# Altium project PROC154E3_SCH.PrjPcb (part 48 of 60)

## Sheet 51. POWER SUPPLY #2.SchDoc: POWER SUPPLY #2
size 513 x 386 mm; Project: PROC154E2(001)_SK_AM69; Issue: 1.0; RevCode: E3; Page Create Date: March  8, 1995; Variant Name: Core Design; Schematic Page Number: 51; Page Number: 51; Page Size: C; Comment: MISTRAL_TITLEBLK_CSIZE_1; Page Count: 62; Schematic Page Count: 62; Name: PROC154E2 001 SK AM69; DsnPath: C:\Users\danie\Downloads\sprr466c\PROC154E3_RP\PROC154E3_SCH.DSN; SchematicName: SCHEMATIC1; PageName: 51. POWER SUPPLY #2; PageSize: C; TopSchematic: True
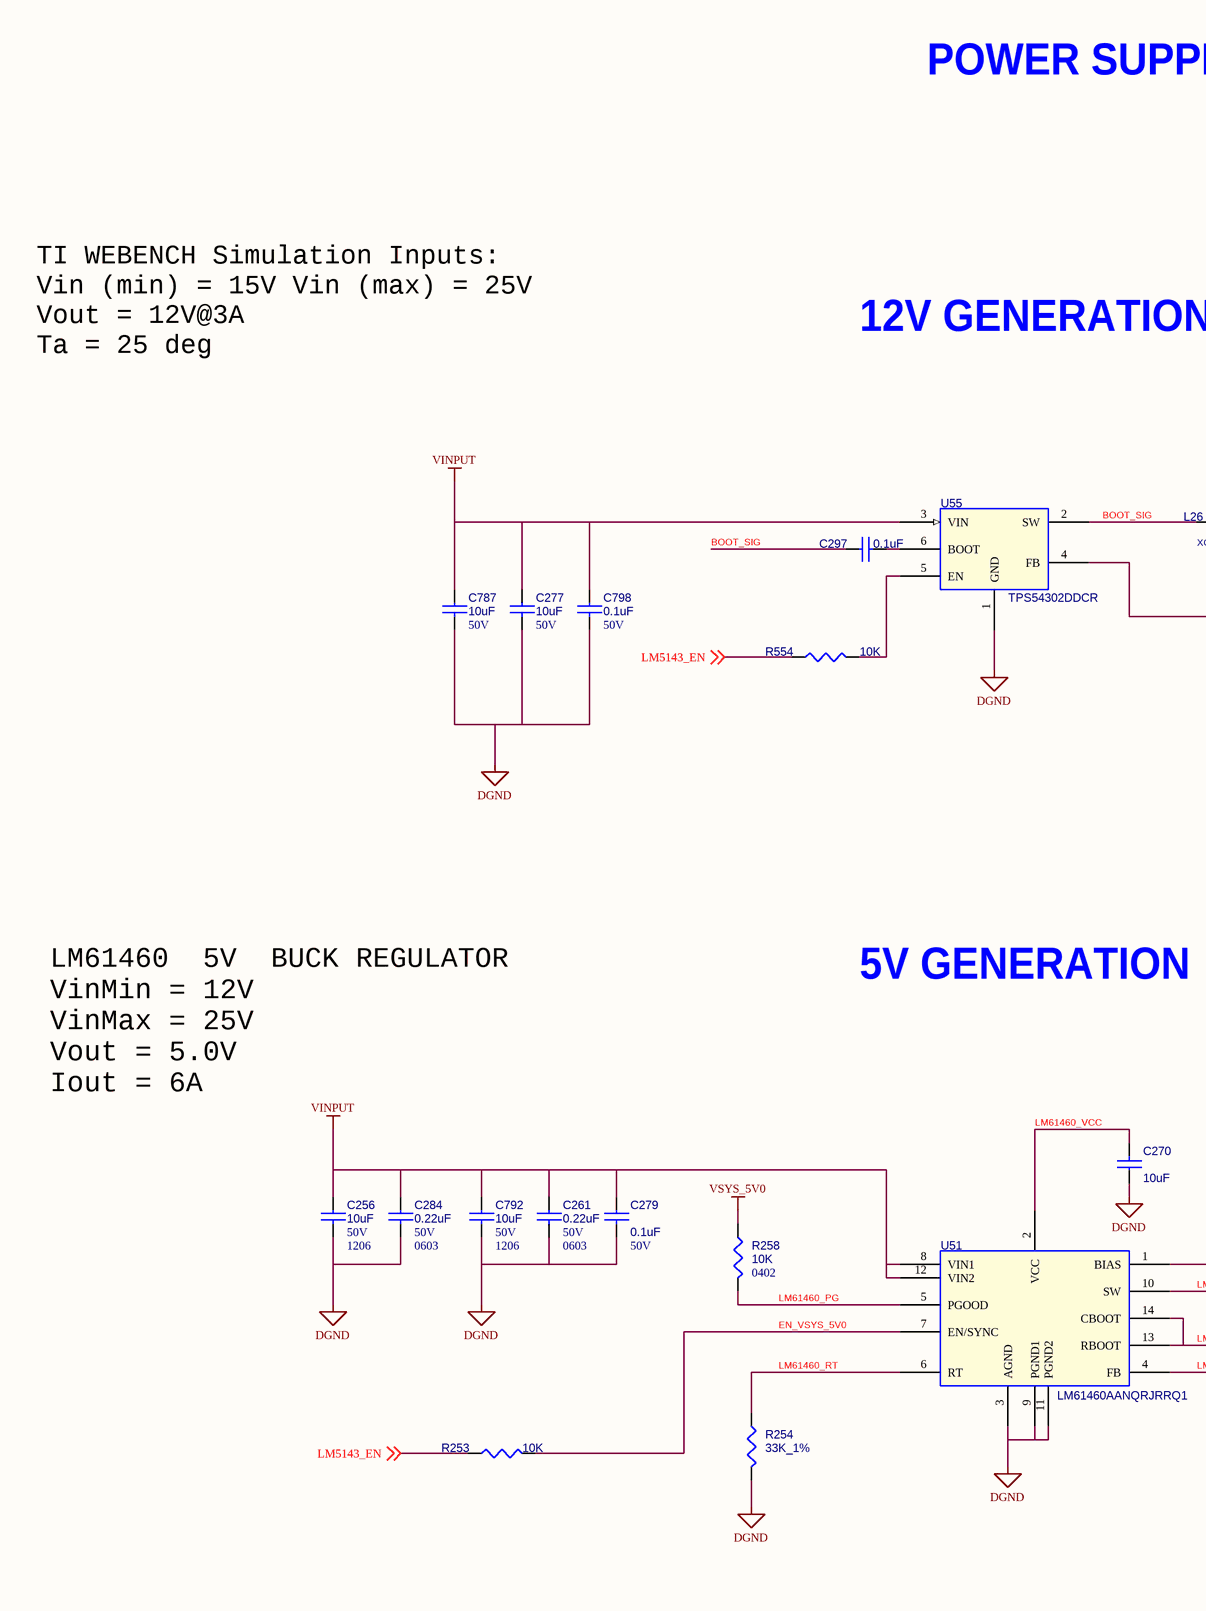
[diagram p85: 51. POWER SUPPLY #2.SchDoc, left]
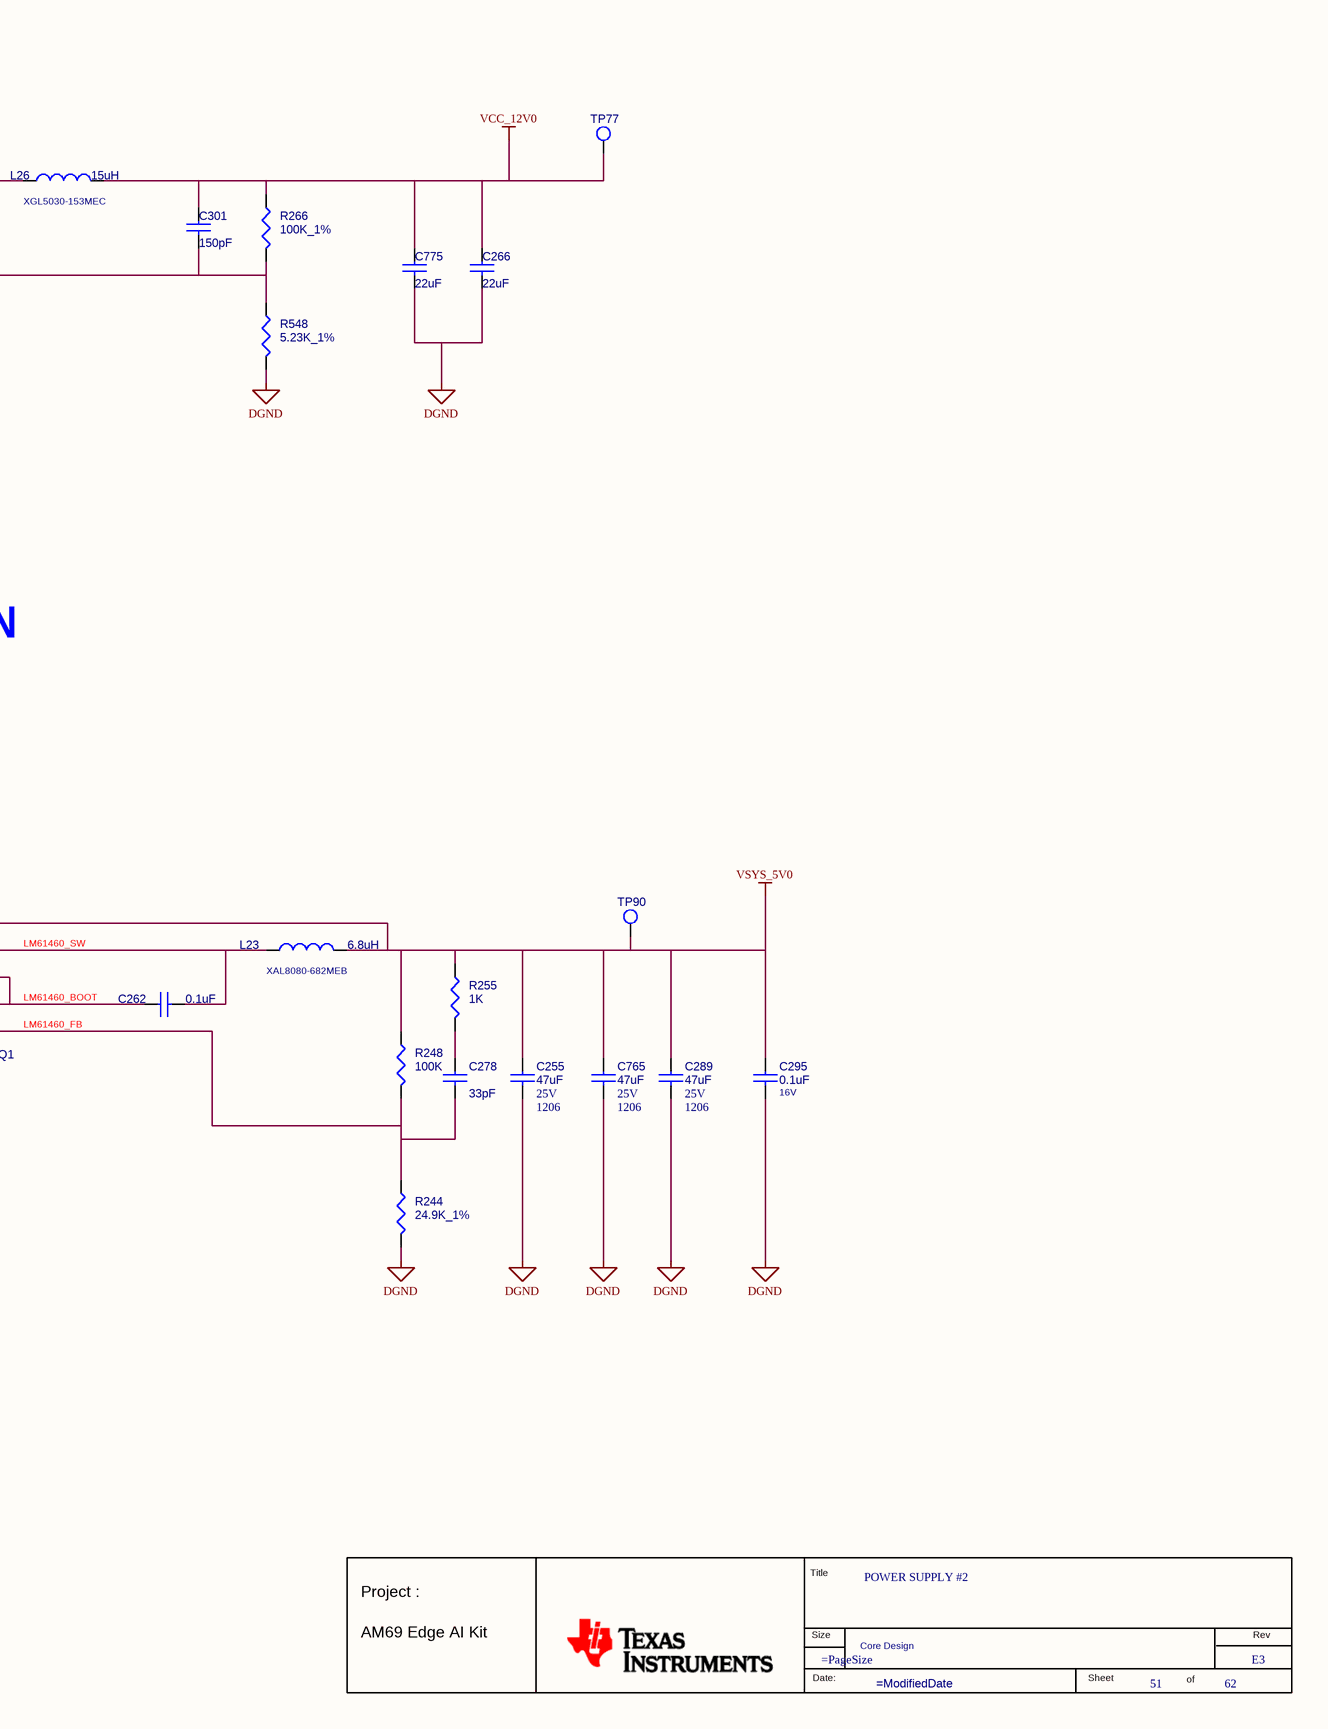
[diagram p86: 51. POWER SUPPLY #2.SchDoc, right]

### Parts
(Parts that share a designator on the sheet are numbered #1, #2 ... from top to bottom, then left to right.)
*#51  RevCode: E3  Title: POWER SUPPLY #2  Page Number: 51  Page Count: 62  Variant Name: Core Design  (hidden comment: MISTRAL_TITLEBLK_CSIZE_1)  (graphical)
C255  47uF  Voltage: 25V  Package: 1206  [CAP1206_2]
C256  10uF  Package: 1206  Voltage: 50V  [CAP1206_2]
C261  0.22uF  Voltage: 50V  Package: 0603  [CAP0603_1]
C262  0.1uF  [CAP0402_0-75]
C266  22uF  [CAP0805_1-5]
C270  10uF  [CAP0402_1]
C277  10uF  Voltage: 50V  [CAP1206_2]
C278  33pF  [CAP0402_0-75]
C279  0.1uF  Voltage: 50V  [CAP0402_0-75]
C284  0.22uF  Package: 0603  Voltage: 50V  [CAP0603_1]
C289  47uF  Voltage: 25V  Package: 1206  [CAP1206_2]
C295  0.1uF  Voltage: 16V  [CAP0402_0-75]
C297  0.1uF  [CAP0805_1]
C301  150pF  [CAP0201_0-5]
C765  47uF  Package: 1206  Voltage: 25V  [CAP1206_2]
C775  22uF  [CAP0805_1-5]
C787  10uF  Voltage: 50V  [CAP1206_2]
C792  10uF  Voltage: 50V  Package: 1206  [CAP1206_2]
C798  0.1uF  Voltage: 50V  [CAP0402_0-75]
L23  6.8uH  Mfr_part_number: XAL8080-682MEB  [IND_XAL8080_330X350_SMD_8]
L26  15uH  Mfr_part_number: XGL5030-153MEC  [IND_XGL5030_220X220_SMD_3-1]
R244  24.9K_1%  [RES0402_0-5]
R248  100K  [RES0402_0-5]
R253  10K  [RES0402_0-5]
R254  33K_1%  [RES0603_0-75]
R255  1K  [RES0201_0-5]
R258  10K  Package: 0402  [RES0402_0-5]
R266  100K_1%  [RES0402_0-5]
R548  5.23K_1%  [RES0402_0-5]
R554  10K  [RES0402_0-5]
TP77  TP30_SMD  [TP30_SMD]  (value not drawn)
TP90  THRU HOLE  [TP_40X65]  (value not drawn)
U51  LM61460AANQRJRRQ1  [VQFNHR14_LM61460_160X140_1]
U55  TPS54302DDCR  [SOT23-6_1-1]

### Nets
DGND: C255.2 C256.2 C261.2 C266.2 C270.1 C277.2 C279.2 C284.2 C289.2 C295.2 C765.2 C775.2 C787.2 C792.2 C798.2 R244.2 R254.2 R548.2 U51.3(AGND) U51.9(PGND1) U51.11(PGND2) U55.1(GND)  [project net VDD_CPU_HCPS_GOSNS]
VCC_12V0: C266.1 C301.1 C775.1 L26.2 R266.1 TP77.1(TP)
VINPUT: C256.1 C261.1 C277.1 C279.1 C284.1 C787.1 C792.1 C798.1 U51.8(VIN1) U51.12(VIN2) U55.3(VIN)
VSYS_5V0: C255.1 C289.1 C295.1 C765.1 L23.2 R248.1 R255.1 R258.2 TP90.1(TP) U51.1(BIAS)
BOOT_SIG: C297.1 L26.1 U55.2(SW)
EN_VSYS_5V0: R253.1 U51.7(EN/SYNC)
LM5143_EN: R253.2 R554.2 ; off-sheet LM5143_EN  [project net LM5143_ON]
LM61460_BOOT: C262.1 U51.13(RBOOT) U51.14(CBOOT)
LM61460_FB: C278.2 R244.1 R248.2 U51.4(FB)
LM61460_PG: R258.1 U51.5(PGOOD)
LM61460_RT: R254.1 U51.6(RT)
LM61460_SW: C262.2 L23.1 U51.10(SW)
LM61460_VCC: C270.2 U51.2(VCC)
NetC278_1: C278.1 R255.2
NetC297_2: C297.2 U55.6(BOOT)
NetC301_2: C301.2 R266.2 R548.1 U55.4(FB)
NetR554_1: R554.1 U55.5(EN)

### Notes on the sheet
- POWER SUPPLY #2
- TI WEBENCH Simulation Inputs:
  Vin (min) = 15V Vin (max) = 25V
  Vout = 12V@3A
  Ta = 25 deg
- 12V GENERATION
- LM61460  5V  BUCK REGULATOR
  VinMin = 12V
  VinMax = 25V
  Vout = 5.0V
  Iout = 6A
- 5V GENERATION
- (in symbol MISTRAL_TITLEBLK_CSIZE_1) Title; Project :; Size; Rev; AM69 Edge AI Kit; Date:; Sheet; of

### Library data of the parts
*#51 = MISTRAL_TITLEBLK_CSIZE_1: Issue: 1.0; Project: PROC154E2(001)_SK_AM69; Name: PROC154E2 001 SK AM69; Page Create Date: March  8, 1995; Page Size: =PageSize; Page Modify Date: =ModifiedDate; Schematic Page Count: 62; Schematic Page Number: 51
C255 = CAP_Dup1: CAP CERAMIC 47uF 25V 20% X5R 1206; Part Reference: C255; Mistral Part No: 120013050002-R; Mfr_name: TDK CORPORATION; Mfr_part_number: C3216X5R1E476M160AC; Part_type: CAPACITORS\CERAMIC; Project: ERP; Wattage: NA; Customs_HS_Code: 85322990; Custom_Duty: 15%; Value: 47uF; Footprint Ref: CAP1206_2; Tolerance: 20%; Distributor_name: DIGIKEY; Distributor_part_number: 445-8047-1-ND; Library Ref: CAP; Height: 1.80MM; Weight: 16.2mg; Temperature: -55°C+85°C; Datasheet: Y:\MIS_DATABASE\DATASHEETS\CAPACITORS\TDK_C-SER-JUL17.PDF; Crtd /date: USMAN/160513; Chkd/date: VASANTHA/261214; MECHANICAL 3D STEP FILE: CAP1206_2; Library Path: Y:\MIS_DATABASE\Library\ALTIUM_TOOL\SCHEMATICS_PARTS\MS_DISCRETE_Library.schlib; Footprint Path: Y:\MIS_DATABASE\Library\ALTIUM_TOOL\PCB_FOOTPRINTS\Altium_Footprint_Lib.PcbLib; PCB Footprint: CAP1206_2
C256 = CAP_Dup1: CAP CERAMIC 10uF 50V 10% X5R AUTO 1206; Part Reference: C256; Part_type: CAPACITORS\CERAMIC; Mfr_part_number: GRT31CR61H106KE01L; Mfr_name: MURATA; Mistral Part No: 120011060019-R; Custom_Duty: 15%; Customs_HS_Code: 85322990; Wattage: NA; Project: LRDE_ABCMV2_MB; Value: 10uF; Footprint Path: Y:\MIS_DATABASE\Library\ALTIUM_TOOL\PCB_FOOTPRINTS\Altium_Footprint_Lib.PcbLib; Library Path: Y:\MIS_DATABASE\Library\ALTIUM_TOOL\SCHEMATICS_PARTS\MS_DISCRETE_Library.schlib; MECHANICAL 3D STEP FILE: CAP1206_2; Chkd/date: MANIRAJA/261018; Crtd /date: ALVY/261018; Datasheet: Y:\MIS_DATABASE\DATASHEETS\CAPACITORS\GRT31CR61H106KE01L.PDF; Temperature: -55°C+85°C; Weight: 16.2mg; Height: 1.80MM; Library Ref: CAP; Distributor_part_number: 490-12456-1-ND; Distributor_name: DIGIKEY; Tolerance: 10%; Footprint Ref: CAP1206_2; PCB Footprint: CAP1206_2
C261 = CAP_Dup1: CAP CERAMIC 0.22uF 50V 10% X7R AUTO 0603; Part Reference: C261; Mistral Part No: 120009090008-R; Mfr_name: MURATA; Mfr_part_number: GCM188R71H224KA64; Part_type: CAPACITORS\CERAMIC; Direct Alternate_mfr_name: TDK; Direct Alternate_mfr_part_number: CGA3E3X7R1H224K080AB; Automotive Alternate_mfr_part_number: CGA3EX7R1H224K080AB; Project: ADE POWER SUPPLY; Wattage: NA; Customs_HS_Code: 85322990; Custom_Duty: 15%; Value: 0.22uF; Footprint Ref: CAP0603_1; Tolerance: 10%; Distributor_name: DIGIKEY; Distributor_part_number: 490-5402-1-ND; Library Ref: CAP; Height: 0.90MM; Weight: 6.3mg; Temperature: -55°C+125°C; Datasheet: Y:\MIS_DATABASE\DATASHEETS\CAPACITORS\MURATA-GCM-SER.PDF; Crtd /date: MAZHAR/110909; Chkd/date: RAGESH/290910; MECHANICAL 3D STEP FILE: CAP0603_1; Library Path: Y:\MIS_DATABASE\Library\ALTIUM_TOOL\SCHEMATICS_PARTS\MS_DISCRETE_Library.schlib; Footprint Path: Y:\MIS_DATABASE\Library\ALTIUM_TOOL\PCB_FOOTPRINTS\Altium_Footprint_Lib.PcbLib; Automotive Alternate_mfr_name: TDK; PCB Footprint: CAP0603_1
C262 = CAP_Dup1: CAP CERAMIC 0.1uF 16V 10% X7R AUTO 0402; Part Reference: C262; Mistral Part No: 120016070006-R; Mfr_name: MURATA; Mfr_part_number: GCM155R71C104KA55D; Part_type: CAPACITORS\CERAMIC; Direct Alternate_mfr_part_number: GCM155R71C104JA55D; Automotive Alternate_mfr_name: TDK; Automotive Alternate_mfr_part_number: CGA2B1X7R1C104K050BC; Project: DCMIST_FPGA_CARD; Wattage: NA; Customs_HS_Code: 85322990; Custom_Duty: 15%; Value: 0.1uF; Footprint Ref: CAP0402_0-75; Tolerance: 10%; Voltage: 16V; Package: 0402; Distributor_name: DIGIKEY; Distributor_part_number: 490-4759-1-ND; Library Ref: CAP; Height: 0.55MM; Weight: 6mg; Temperature: -55°C+125°C; Datasheet: Y:\MIS_DATABASE\DATASHEETS\CAPACITORS\MURATA-GCM-SER.PDF; Crtd /date: VASANTHA/300514; Chkd/date: NAVEED/021014; MECHANICAL 3D STEP FILE: CAP0402_0-75; Library Path: Y:\MIS_DATABASE\Library\ALTIUM_TOOL\SCHEMATICS_PARTS\MS_DISCRETE_Library.schlib; Footprint Path: Y:\MIS_DATABASE\Library\ALTIUM_TOOL\PCB_FOOTPRINTS\Altium_Footprint_Lib.PcbLib; Direct Alternate_mfr_name: MURATA; PCB Footprint: CAP0402_0-75
C266 = CAP_Dup1: CAP CERAMIC 22uF 25V 20% X5R 0805; Part Reference: C266; Part_type: CAPACITORS\CERAMIC; Mfr_part_number: GRM21BR61E226ME44K; Mfr_name: MURATA; Mistral Part No: 120013120018-R; Custom_Duty: 15%; Customs_HS_Code: 85322990; Wattage: NA; Project: TI_J7SVB_PCIE_ADD-ON-CARD; Value: 22uF; MECHANICAL 3D STEP FILE: CAP0805_1-5; Chkd/date: MANIRAJA/110718; Crtd /date: ALVY/110718; Datasheet: Y:\MIS_DATABASE\DATASHEETS\CAPACITORS\GRM21BR61E226ME44K.PDF; Temperature: -55°C+85°C; Weight: 9.5mg; Height: 1.45MM; Library Ref: CAP; Distributor_part_number: 490-14661-1-ND; Distributor_name: DIGIKEY; Package: 0805; Voltage: 25V; Tolerance: 20%; Footprint Ref: CAP0805_1-5; Library Path: Y:\MIS_DATABASE\Library\ALTIUM_TOOL\SCHEMATICS_PARTS\MS_DISCRETE_Library.schlib; Footprint Path: Y:\MIS_DATABASE\Library\ALTIUM_TOOL\PCB_FOOTPRINTS\Altium_Footprint_Lib.PcbLib; PCB Footprint: CAP0805_1-5
C270 = CAP_Dup1: CAP CERAMIC 10uF 10V 20% X5R 0402; Part Reference: C270; Part_type: CAPACITORS\CERAMIC; Mfr_part_number: CL05A106MP8NUB8; Mfr_name: SAMSUNG; Mistral Part No: 120019020008-R; Custom_Duty: 15%; Customs_HS_Code: 85322990; Wattage: NA; Project: TI_60GHz-AOP; Value: 10uF; Footprint Path: Y:\MIS_DATABASE\Library\ALTIUM_TOOL\PCB_FOOTPRINTS\Altium_Footprint_Lib.PcbLib; Library Path: Y:\MIS_DATABASE\Library\ALTIUM_TOOL\SCHEMATICS_PARTS\MS_DISCRETE_Library.schlib; MECHANICAL 3D STEP FILE: CAP0402_1; Chkd/date: MANIRAJA/150219; Crtd /date: ALVY/150219; Datasheet: Y:\MIS_DATABASE\DATASHEETS\CAPACITORS\CL05A106MP8NUB8.PDF; Temperature: -55°C+85°C; Weight: NA; Height: 0.90MM; Library Ref: CAP; Distributor_part_number: 1276-6830-1-ND; Distributor_name: DIGIKEY; Package: 0402; Voltage: 10V; Tolerance: 20%; Footprint Ref: CAP0402_1; PCB Footprint: CAP0402_1
C277 = CAP_Dup1: CAP CERAMIC 10uF 50V 10% X5R AUTO 1206; Part Reference: C277; Mistral Part No: 120011060019-R; Mfr_name: MURATA; Mfr_part_number: GRT31CR61H106KE01L; Part_type: CAPACITORS\CERAMIC; Direct Alternate_mfr_name: SAMSUNG; Direct Alternate_mfr_part_number: CL31A106KBHNNNE; Automotive Alternate_mfr_name: TDK; Automotive Alternate_mfr_part_number: CGA5L1X7R1H106K160AC; Project: LRDE_ABCMV2_MB; Wattage: NA; Customs_HS_Code: 85322990; Custom_Duty: 15%; Value: 10uF; Footprint Path: Y:\MIS_DATABASE\Library\ALTIUM_TOOL\PCB_FOOTPRINTS\Altium_Footprint_Lib.PcbLib; Library Path: Y:\MIS_DATABASE\Library\ALTIUM_TOOL\SCHEMATICS_PARTS\MS_DISCRETE_Library.schlib; Footprint Ref: CAP1206_2; MECHANICAL 3D STEP FILE: CAP1206_2; Tolerance: 10%; Package: 1206; Distributor_name: DIGIKEY; Distributor_part_number: 490-12456-1-ND; Library Ref: CAP; Height: 1.80MM; Weight: 16.2mg; Temperature: -55°C+85°C; Datasheet: Y:\MIS_DATABASE\DATASHEETS\CAPACITORS\GRT31CR61H106KE01L.PDF; Crtd /date: ALVY/261018; Chkd/date: MANIRAJA/261018; PCB Footprint: CAP1206_2
C278 = CAP_Dup1: CAP CERAMIC 33pF 50V 5% HI-Q C0G(NP0) AUTO 0402; Part Reference: C278; Mistral Part No: 120021020039-R; Mfr_name: MURATA; Mfr_part_number: GCQ1555C1H330JB01D; Part_type: CAPACITORS\CERAMIC; Project: TI_DRA821 SK EVM BRD; Wattage: NA; Customs_HS_Code: 85322990; Custom_Duty: 15%; Value: 33pF; Footprint Ref: CAP0402_0-75; Tolerance: 5%; Voltage: 50V; Package: 0402; Distributor_name: DIGIKEY; Distributor_part_number: 490-17458-1-ND; Library Ref: CAP; Height: 0.55MM; Weight: NA; Temperature: -55°C+125°C; Datasheet: Y:\MIS_DATABASE\DATASHEETS\CAPACITORS\GCQ1555C1H330JB01.PDF; Crtd /date: ALVY/240221; Chkd/date: MANIRAJA/250221; MECHANICAL 3D STEP FILE: CAP0402_0-75; Library Path: Y:\MIS_DATABASE\Library\ALTIUM_TOOL\SCHEMATICS_PARTS\MS_DISCRETE_Library.schlib; Footprint Path: Y:\MIS_DATABASE\Library\ALTIUM_TOOL\PCB_FOOTPRINTS\Altium_Footprint_Lib.PcbLib; PCB Footprint: CAP0402_0-75
C279 = CAP_Dup1: CAP CERAMIC 0.1uF 50V 10% X7R AUTO 0402; Part Reference: C279; Mistral Part No: 120019030005-R; Mfr_name: MURATA; Mfr_part_number: GRT155R71H104KE01D; Part_type: CAPACITORS\CERAMIC; Project: TI_DRA821 SK EVM BRD; Wattage: NA; Customs_HS_Code: 85322990; Custom_Duty: 15%; Value: 0.1uF; Footprint Ref: CAP0402_0-75; Tolerance: 10%; Package: 0402; Distributor_name: MOUSER; Distributor_part_number: 81-GRT155R71H104KE1D; Library Ref: CAP; Height: 0.55MM; Weight: NA; Temperature: -55°C+125°C; Datasheet: Y:\MIS_DATABASE\DATASHEETS\CAPACITORS\GRT155R71H104KE01.PDF; Crtd /date: ALVY/240221; Chkd/date: MANIRAJA/250221; MECHANICAL 3D STEP FILE: CAP0402_0-75; Library Path: Y:\MIS_DATABASE\Library\ALTIUM_TOOL\SCHEMATICS_PARTS\MS_DISCRETE_Library.schlib; Footprint Path: Y:\MIS_DATABASE\Library\ALTIUM_TOOL\PCB_FOOTPRINTS\Altium_Footprint_Lib.PcbLib; PCB Footprint: CAP0402_0-75
C284 = CAP_Dup1: CAP CERAMIC 0.22uF 50V 10% X7R AUTO 0603; Part Reference: C284; Part_type: CAPACITORS\CERAMIC; Mfr_part_number: GCM188R71H224KA64; Mfr_name: MURATA; Mistral Part No: 120009090008-R; Direct Alternate_mfr_name: TDK; Direct Alternate_mfr_part_number: CGA3E3X7R1H224K080AB; Automotive Alternate_mfr_part_number: CGA3EX7R1H224K080AB; Custom_Duty: 15%; Customs_HS_Code: 85322990; Wattage: NA; Project: ADE POWER SUPPLY; Value: 0.22uF; Footprint Path: Y:\MIS_DATABASE\Library\ALTIUM_TOOL\PCB_FOOTPRINTS\Altium_Footprint_Lib.PcbLib; Library Path: Y:\MIS_DATABASE\Library\ALTIUM_TOOL\SCHEMATICS_PARTS\MS_DISCRETE_Library.schlib; MECHANICAL 3D STEP FILE: CAP0603_1; Chkd/date: RAGESH/290910; Crtd /date: MAZHAR/110909; Datasheet: Y:\MIS_DATABASE\DATASHEETS\CAPACITORS\MURATA-GCM-SER.PDF; Temperature: -55°C+125°C; Weight: 6.3mg; Height: 0.90MM; Library Ref: CAP; Distributor_part_number: 490-5402-1-ND; Distributor_name: DIGIKEY; Tolerance: 10%; Footprint Ref: CAP0603_1; Automotive Alternate_mfr_name: TDK; PCB Footprint: CAP0603_1
C289 = CAP_Dup1: CAP CERAMIC 47uF 25V 20% X5R 1206; Part Reference: C289; Mistral Part No: 120013050002-R; Mfr_name: TDK CORPORATION; Mfr_part_number: C3216X5R1E476M160AC; Part_type: CAPACITORS\CERAMIC; Project: ERP; Wattage: NA; Customs_HS_Code: 85322990; Custom_Duty: 15%; Value: 47uF; Footprint Ref: CAP1206_2; Tolerance: 20%; Distributor_name: DIGIKEY; Distributor_part_number: 445-8047-1-ND; Library Ref: CAP; Height: 1.80MM; Weight: 16.2mg; Temperature: -55°C+85°C; Datasheet: Y:\MIS_DATABASE\DATASHEETS\CAPACITORS\TDK_C-SER-JUL17.PDF; Crtd /date: USMAN/160513; Chkd/date: VASANTHA/261214; MECHANICAL 3D STEP FILE: CAP1206_2; Library Path: Y:\MIS_DATABASE\Library\ALTIUM_TOOL\SCHEMATICS_PARTS\MS_DISCRETE_Library.schlib; Footprint Path: Y:\MIS_DATABASE\Library\ALTIUM_TOOL\PCB_FOOTPRINTS\Altium_Footprint_Lib.PcbLib; PCB Footprint: CAP1206_2
C295 = CAP_Dup1: CAP CERAMIC 0.1uF 16V 10% X7R AUTO 0402; Part Reference: C295; Part_type: CAPACITORS\CERAMIC; Mfr_part_number: GCM155R71C104KA55D; Mfr_name: MURATA; Mistral Part No: 120016070006-R; Direct Alternate_mfr_part_number: GCM155R71C104JA55D; Automotive Alternate_mfr_name: TDK; Automotive Alternate_mfr_part_number: CGA2B1X7R1C104K050BC; Custom_Duty: 15%; Customs_HS_Code: 85322990; Wattage: NA; Project: DCMIST_FPGA_CARD; Value: 0.1uF; Footprint Path: Y:\MIS_DATABASE\Library\ALTIUM_TOOL\PCB_FOOTPRINTS\Altium_Footprint_Lib.PcbLib; Library Path: Y:\MIS_DATABASE\Library\ALTIUM_TOOL\SCHEMATICS_PARTS\MS_DISCRETE_Library.schlib; MECHANICAL 3D STEP FILE: CAP0402_0-75; Chkd/date: NAVEED/021014; Crtd /date: VASANTHA/300514; Datasheet: Y:\MIS_DATABASE\DATASHEETS\CAPACITORS\MURATA-GCM-SER.PDF; Temperature: -55°C+125°C; Weight: 6mg; Height: 0.55MM; Library Ref: CAP; Distributor_part_number: 490-4759-1-ND; Distributor_name: DIGIKEY; Package: 0402; Tolerance: 10%; Footprint Ref: CAP0402_0-75; Direct Alternate_mfr_name: MURATA; PCB Footprint: CAP0402_0-75
C297 = CAP_Dup1: CAP CERAMIC 0.1uF 50V 20% X7R 0805; Part Reference: C297; Part_type: CAPACITORS\CERAMIC; Mfr_part_number: C0805C104M5RACTU; Mfr_name: KEMET; Mistral Part No: 120019060010-R; Custom_Duty: 15%; Customs_HS_Code: 85322990; Wattage: NA; Project: MYTHIC_FORMFACTOR_BRD; Value: 0.1uF; Footprint Path: Y:\MIS_DATABASE\Library\ALTIUM_TOOL\PCB_FOOTPRINTS\Altium_Footprint_Lib.PcbLib; Library Path: Y:\MIS_DATABASE\Library\ALTIUM_TOOL\SCHEMATICS_PARTS\MS_DISCRETE_Library.schlib; MECHANICAL 3D STEP FILE: CAP0805_1; Chkd/date: MANIRAJA/040619; Crtd /date: ALVY/030619; Datasheet: Y:\MIS_DATABASE\DATASHEETS\CAPACITORS\KEMET-C-X7R.PDF; Temperature: -55°C+125°C; Weight: 5.5mg; Height: 0.88MM; Library Ref: CAP; Distributor_part_number: 399-1169-1-ND; Distributor_name: DIGIKEY; Package: 0805; Voltage: 50V; Tolerance: 20%; Footprint Ref: CAP0805_1; PCB Footprint: CAP0805_1
C301 = CAP_Dup1: CAP CERAMIC 150pF 25V 10% X7R 0201; Part Reference: C301; Part_type: CAPACITORS\CERAMIC; Mfr_part_number: GRM033R71E151KA01D; Mfr_name: MURATA; Mistral Part No: 120020050029-R; Custom_Duty: 15%; Customs_HS_Code: 85322990; Wattage: NA; Project: QCS610_NANOSOM; Value: 150pF; Footprint Path: Y:\MIS_DATABASE\Library\ALTIUM_TOOL\PCB_FOOTPRINTS\Altium_Footprint_Lib.PcbLib; Library Path: Y:\MIS_DATABASE\Library\ALTIUM_TOOL\SCHEMATICS_PARTS\MS_DISCRETE_Library.schlib; MECHANICAL 3D STEP FILE: CAP0201_0-5; Chkd/date: MANIRAJA/300520; Crtd /date: ALVY/260520; Datasheet: Y:\MIS_DATABASE\DATASHEETS\CAPACITORS\GRM033R71E151KA01.PDF; Temperature: -55°C+125°C; Weight: 0.33mg; Height: 0.33MM; Library Ref: CAP; Distributor_part_number: 490-3174-1-ND; Distributor_name: DIGIKEY; Package: 0201; Voltage: 25V; Tolerance: 10%; Footprint Ref: CAP0201_0-5; PCB Footprint: CAP0201_0-5
C765 = CAP_Dup1: CAP CERAMIC 47uF 25V 20% X5R 1206; Part Reference: C765; Part_type: CAPACITORS\CERAMIC; Mfr_part_number: C3216X5R1E476M160AC; Mfr_name: TDK CORPORATION; Mistral Part No: 120013050002-R; Custom_Duty: 15%; Customs_HS_Code: 85322990; Wattage: NA; Project: ERP; Value: 47uF; Footprint Path: Y:\MIS_DATABASE\Library\ALTIUM_TOOL\PCB_FOOTPRINTS\Altium_Footprint_Lib.PcbLib; Library Path: Y:\MIS_DATABASE\Library\ALTIUM_TOOL\SCHEMATICS_PARTS\MS_DISCRETE_Library.schlib; MECHANICAL 3D STEP FILE: CAP1206_2; Chkd/date: VASANTHA/261214; Crtd /date: USMAN/160513; Datasheet: Y:\MIS_DATABASE\DATASHEETS\CAPACITORS\TDK_C-SER-JUL17.PDF; Temperature: -55°C+85°C; Weight: 16.2mg; Height: 1.80MM; Library Ref: CAP; Distributor_part_number: 445-8047-1-ND; Distributor_name: DIGIKEY; Tolerance: 20%; Footprint Ref: CAP1206_2; PCB Footprint: CAP1206_2
C775 = CAP_Dup1: CAP CERAMIC 22uF 25V 20% X5R 0805; Part Reference: C775; Mistral Part No: 120013120018-R; Mfr_name: MURATA; Mfr_part_number: GRM21BR61E226ME44K; Part_type: CAPACITORS\CERAMIC; Project: TI_J7SVB_PCIE_ADD-ON-CARD; Wattage: NA; Customs_HS_Code: 85322990; Custom_Duty: 15%; Value: 22uF; Footprint Path: Y:\MIS_DATABASE\Library\ALTIUM_TOOL\PCB_FOOTPRINTS\Altium_Footprint_Lib.PcbLib; Library Path: Y:\MIS_DATABASE\Library\ALTIUM_TOOL\SCHEMATICS_PARTS\MS_DISCRETE_Library.schlib; Footprint Ref: CAP0805_1-5; Tolerance: 20%; Voltage: 25V; Package: 0805; Distributor_name: DIGIKEY; Distributor_part_number: 490-14661-1-ND; Library Ref: CAP; Height: 1.45MM; Weight: 9.5mg; Temperature: -55°C+85°C; Datasheet: Y:\MIS_DATABASE\DATASHEETS\CAPACITORS\GRM21BR61E226ME44K.PDF; Crtd /date: ALVY/110718; Chkd/date: MANIRAJA/110718; MECHANICAL 3D STEP FILE: CAP0805_1-5; PCB Footprint: CAP0805_1-5
C787 = CAP_Dup1: CAP CERAMIC 10uF 50V 10% X5R AUTO 1206; Part Reference: C787; Mistral Part No: 120011060019-R; Mfr_name: MURATA; Mfr_part_number: GRT31CR61H106KE01L; Part_type: CAPACITORS\CERAMIC; Direct Alternate_mfr_name: SAMSUNG; Direct Alternate_mfr_part_number: CL31A106KBHNNNE; Automotive Alternate_mfr_name: TDK; Automotive Alternate_mfr_part_number: CGA5L1X7R1H106K160AC; Project: LRDE_ABCMV2_MB; Wattage: NA; Customs_HS_Code: 85322990; Custom_Duty: 15%; Value: 10uF; Footprint Path: Y:\MIS_DATABASE\Library\ALTIUM_TOOL\PCB_FOOTPRINTS\Altium_Footprint_Lib.PcbLib; Library Path: Y:\MIS_DATABASE\Library\ALTIUM_TOOL\SCHEMATICS_PARTS\MS_DISCRETE_Library.schlib; Footprint Ref: CAP1206_2; MECHANICAL 3D STEP FILE: CAP1206_2; Tolerance: 10%; Package: 1206; Distributor_name: DIGIKEY; Distributor_part_number: 490-12456-1-ND; Library Ref: CAP; Height: 1.80MM; Weight: 16.2mg; Temperature: -55°C+85°C; Datasheet: Y:\MIS_DATABASE\DATASHEETS\CAPACITORS\GRT31CR61H106KE01L.PDF; Crtd /date: ALVY/261018; Chkd/date: MANIRAJA/261018; PCB Footprint: CAP1206_2
C792 = CAP_Dup1: CAP CERAMIC 10uF 50V 10% X5R AUTO 1206; Part Reference: C792; Mistral Part No: 120011060019-R; Mfr_name: MURATA; Mfr_part_number: GRT31CR61H106KE01L; Part_type: CAPACITORS\CERAMIC; Project: LRDE_ABCMV2_MB; Wattage: NA; Customs_HS_Code: 85322990; Custom_Duty: 15%; Value: 10uF; Footprint Ref: CAP1206_2; Tolerance: 10%; Distributor_name: DIGIKEY; Distributor_part_number: 490-12456-1-ND; Library Ref: CAP; Height: 1.80MM; Weight: 16.2mg; Temperature: -55°C+85°C; Datasheet: Y:\MIS_DATABASE\DATASHEETS\CAPACITORS\GRT31CR61H106KE01L.PDF; Crtd /date: ALVY/261018; Chkd/date: MANIRAJA/261018; MECHANICAL 3D STEP FILE: CAP1206_2; Library Path: Y:\MIS_DATABASE\Library\ALTIUM_TOOL\SCHEMATICS_PARTS\MS_DISCRETE_Library.schlib; Footprint Path: Y:\MIS_DATABASE\Library\ALTIUM_TOOL\PCB_FOOTPRINTS\Altium_Footprint_Lib.PcbLib; PCB Footprint: CAP1206_2
C798 = CAP_Dup1: CAP CERAMIC 0.1uF 50V 10% X7R AUTO 0402; Part Reference: C798; Part_type: CAPACITORS\CERAMIC; Mfr_part_number: GRT155R71H104KE01D; Mfr_name: MURATA; Mistral Part No: 120019030005-R; Custom_Duty: 15%; Customs_HS_Code: 85322990; Wattage: NA; Project: TI_DRA821 SK EVM BRD; Value: 0.1uF; Footprint Path: Y:\MIS_DATABASE\Library\ALTIUM_TOOL\PCB_FOOTPRINTS\Altium_Footprint_Lib.PcbLib; Library Path: Y:\MIS_DATABASE\Library\ALTIUM_TOOL\SCHEMATICS_PARTS\MS_DISCRETE_Library.schlib; Footprint Ref: CAP0402_0-75; Chkd/date: MANIRAJA/250221; Crtd /date: ALVY/240221; Datasheet: Y:\MIS_DATABASE\DATASHEETS\CAPACITORS\GRT155R71H104KE01.PDF; Temperature: -55°C+125°C; Weight: NA; Height: 0.55MM; Library Ref: CAP; Distributor_part_number: 81-GRT155R71H104KE1D; Distributor_name: MOUSER; Package: 0402; Tolerance: 10%; MECHANICAL 3D STEP FILE: CAP0402_0-75; PCB Footprint: CAP0402_0-75
L23 = INDUCTOR: IND POWER 6.8uH 11.3A 20% SMD; Part Reference: L23; Mfr_name: COILCRAFT; Mistral Part No: 130021020022-R; Custom_Duty: 24%; Customs_HS_Code: 85437099; Wattage: NA; Project: J7ES_SK_BRD; Value: 6.8uH; Chkd/date: ALVY/040221; Crtd /date: MANIRAJA/030221; Datasheet: Y:\MIS_DATABASE\DATASHEETS\DISCRETES\INDUCTORS\XAL8080-SER.PDF; Temperature: -40°C+125°C; Weight: 3000mg; Height: 8.00MM; Library Ref: INDUCTOR; Distributor_part_number: 994-XAL8080-682MEB; Distributor_name: MOUSER; Package: SMD; Voltage: NA; Tolerance: 20%; Part_type: INDUCTOR; Footprint Ref: IND_XAL8080_330X350_SMD_8; MECHANICAL 3D STEP FILE: IND_XAL8080_330X350_SMD_8; Library Path: Y:\MIS_DATABASE\Library\ALTIUM_TOOL\SCHEMATICS_PARTS\MS_DISCRETE_Library.schlib; Footprint Path: Y:\MIS_DATABASE\Library\ALTIUM_TOOL\PCB_FOOTPRINTS\Altium_Footprint_Lib.PcbLib; PCB Footprint: IND_XAL8080_330X350_SMD_8
L26 = INDUCTOR: IND POWER 15uH 4.5A 20% SMD; Part Reference: L26; Mistral Part No: 130022040005-R; Mfr_name: COILCRAFT; Project: BRUKER_COMMANDO_PH2_BRD; Voltage: NA; Customs_HS_Code: 85437099; Custom_Duty: 24%; Value: 15uH; Footprint Ref: IND_XGL5030_220X220_SMD_3-1; Part_type: INDUCTOR; Tolerance: 20%; Wattage: NA; Package: SMD; Distributor_name: NA; Distributor_part_number: NA; Library Ref: INDUCTOR; Height: 3.10MM; Weight: 520mg; Temperature: -40°C+125°C; Datasheet: Y:\MIS_DATABASE\DATASHEETS\DISCRETES\INDUCTORS\XGL5030.PDF; Crtd /date: ALVY/050422; Chkd/date: ALVY/050422; MECHANICAL 3D STEP FILE: IND_XGL5030_220X220_SMD_3-1; Library Path: Y:\MIS_DATABASE\Library\ALTIUM_TOOL\SCHEMATICS_PARTS\MS_DISCRETE_Library.schlib; Footprint Path: Y:\MIS_DATABASE\Library\ALTIUM_TOOL\PCB_FOOTPRINTS\Altium_Footprint_Lib.PcbLib; PCB Footprint: IND_XGL5030_220X220_SMD_3-1
R244 = RESISTOR_Dup2: RES 24.9K 1/16W 1% 0402; Part Reference: R244; Mistral Part No: 110009030538-R; Mfr_name: VISHAY; Mfr_part_number: CRCW040224K9FKED; Part_type: RESISTORS\FIXED; Project: AM64x-GP_EVM BRD; Voltage: NA; Customs_HS_Code: 85332119; Custom_Duty: 15%; Value: 24.9K_1%; Footprint Ref: RES0402_0-5; Tolerance: 1%; Wattage: 1/16W; Package: 0402; Distributor_name: DIGIKEY; Distributor_part_number: 541-24.9KLCT-ND; Library Ref: RESISTOR; Height: 0.40MM; Weight: 0.65mg; Temperature: -55°C+155°C; Datasheet: Y:\MIS_DATABASE\DATASHEETS\RESISTORS\CRCW0603.PDF; Crtd /date: ALVY/070520; Chkd/date: MANIRAJA/080520; MECHANICAL 3D STEP FILE: RES0402_0-5; Library Path: Y:\MIS_DATABASE\Library\ALTIUM_TOOL\SCHEMATICS_PARTS\MS_DISCRETE_Library.schlib; Footprint Path: Y:\MIS_DATABASE\Library\ALTIUM_TOOL\PCB_FOOTPRINTS\Altium_Footprint_Lib.PcbLib; PCB Footprint: RES0402_0-5
R248 = RESISTOR_Dup2: RES 100K 1/10W 5% 0402; Part Reference: R248; Part_type: RESISTORS\FIXED; Mfr_part_number: ERJ-2GEJ104X; Mfr_name: PANASONIC-ECG; Mistral Part No: 110009030177-R; Custom_Duty: 15%; Customs_HS_Code: 85332119; Voltage: NA; Project: RED EYE; Value: 100K; Footprint Path: Y:\MIS_DATABASE\Library\ALTIUM_TOOL\PCB_FOOTPRINTS\Altium_Footprint_Lib.PcbLib; Library Path: Y:\MIS_DATABASE\Library\ALTIUM_TOOL\SCHEMATICS_PARTS\MS_DISCRETE_Library.schlib; MECHANICAL 3D STEP FILE: RES0402_0-5; Chkd/date: VASANTHA/291216; Crtd /date: GEETHA/190406; Datasheet: Y:\MIS_DATABASE\DATASHEETS\RESISTORS\PAN-ERJSER_NOV17.PDF; Temperature: -55°C+155°C; Weight: 0.8mg; Height: 0.40MM; Library Ref: RESISTOR; Distributor_part_number: P100KJCT-ND; Distributor_name: DIGIKEY; Package: 0402; Wattage: 1/10W; Tolerance: 5%; Footprint Ref: RES0402_0-5; PCB Footprint: RES0402_0-5
R253 = RESISTOR_Dup2: RES 10K 1/16W 5% 0402; Part Reference: R253; Part_type: RESISTORS\FIXED; Mfr_part_number: RC0402JR-0710KL; Mfr_name: YAGEO AMERICA; Mistral Part No: 110011060021-R; Custom_Duty: 15%; Customs_HS_Code: 85332119; Voltage: NA; Project: HSE; Value: 10K; Footprint Path: Y:\MIS_DATABASE\Library\ALTIUM_TOOL\PCB_FOOTPRINTS\Altium_Footprint_Lib.PcbLib; Library Path: Y:\MIS_DATABASE\Library\ALTIUM_TOOL\SCHEMATICS_PARTS\MS_DISCRETE_Library.schlib; MECHANICAL 3D STEP FILE: RES0402_0-5; Chkd/date: VASANTHA/061216; Crtd /date: MAZHAR/230805; Datasheet: Y:\MIS_DATABASE\DATASHEETS\RESISTORS\RCXXXXL-SER_MAR18.PDF; Temperature: -55°C+155°C; Weight: 0.65mg; Height: 0.40MM; Library Ref: RESISTOR; Distributor_part_number: 311-10KJRCT-ND; Distributor_name: DIGIKEY; Package: 0402; Wattage: 1/16W; Tolerance: 5%; Footprint Ref: RES0402_0-5; PCB Footprint: RES0402_0-5
R254 = RESISTOR_Dup2: RES 33K 1/10W 1% 0603; Part Reference: R254; Part_type: RESISTORS\FIXED; Mfr_part_number: RC0603FR-0733KL; Mfr_name: YAGEO AMERICA; Mistral Part No: 110014070055-R; Custom_Duty: 15%; Customs_HS_Code: 85332119; Voltage: NA; Project: DRDL_ITS2_RO-PC; Value: 33K_1%; Footprint Path: Y:\MIS_DATABASE\Library\ALTIUM_TOOL\PCB_FOOTPRINTS\Altium_Footprint_Lib.PcbLib; Library Path: Y:\MIS_DATABASE\Library\ALTIUM_TOOL\SCHEMATICS_PARTS\MS_DISCRETE_Library.schlib; MECHANICAL 3D STEP FILE: RES0603_0-75; Chkd/date: MANIRAJA/100118; Crtd /date: ALVY/100118; Datasheet: Y:\MIS_DATABASE\DATASHEETS\RESISTORS\RCXXXXL-SER_MAR18.PDF; Temperature: -55°C+155°C; Weight: 2mg; Height: 0.55MM; Library Ref: RESISTOR; Distributor_part_number: 311-33.0KHRCT-ND; Distributor_name: DIGIKEY; Package: 0603; Wattage: 1/10W; Tolerance: 1%; Footprint Ref: RES0603_0-75; PCB Footprint: RES0603_0-75
R255 = RESISTOR_Dup1: RES 1K 1/20W 5% 0201; Part Reference: R255; Mistral Part No: 110009030395-R; Mfr_name: YAGEO AMERICA; Mfr_part_number: RC0201JR-071KL; Part_type: RESISTORS\FIXED; Project: GOLDEN-I LITE; Voltage: NA; Customs_HS_Code: 85332119; Custom_Duty: 15%; Value: 1K; Library Ref: RESISTOR; Tolerance: 5%; Wattage: 1/20W; Package: 0201; Distributor_name: DIGIKEY; Distributor_part_number: 311-1KNCT-ND; Height: 0.26MM; Weight: 0.17mg; Temperature: -55°C+125°C; Datasheet: Y:\MIS_DATABASE\DATASHEETS\RESISTORS\RCXXXXL-SER_MAR18.PDF; Crtd /date: MANIRAJA/050517; Chkd/date: MANIRAJA/050517; Footprint Ref: RES0201_0-5; MECHANICAL 3D STEP FILE: RES0201_0-5; Library Path: Y:\MIS_DATABASE\Library\ALTIUM_TOOL\SCHEMATICS_PARTS\MS_DISCRETE_Library.schlib; Footprint Path: Y:\MIS_DATABASE\Library\ALTIUM_TOOL\PCB_FOOTPRINTS\Altium_Footprint_Lib.PcbLib; PCB Footprint: RES0201_0-5
R258 = RESISTOR_Dup2: RES 10K 1/16W 5% 0402; Part Reference: R258; Part_type: RESISTORS\FIXED; Mfr_part_number: RC0402JR-0710KL; Mfr_name: YAGEO AMERICA; Mistral Part No: 110011060021-R; Custom_Duty: 15%; Customs_HS_Code: 85332119; Voltage: NA; Project: HSE; Value: 10K; Footprint Path: Y:\MIS_DATABASE\Library\ALTIUM_TOOL\PCB_FOOTPRINTS\Altium_Footprint_Lib.PcbLib; Library Path: Y:\MIS_DATABASE\Library\ALTIUM_TOOL\SCHEMATICS_PARTS\MS_DISCRETE_Library.schlib; MECHANICAL 3D STEP FILE: RES0402_0-5; Chkd/date: VASANTHA/061216; Crtd /date: MAZHAR/230805; Datasheet: Y:\MIS_DATABASE\DATASHEETS\RESISTORS\RCXXXXL-SER_MAR18.PDF; Temperature: -55°C+155°C; Weight: 0.65mg; Height: 0.40MM; Library Ref: RESISTOR; Distributor_part_number: 311-10KJRCT-ND; Distributor_name: DIGIKEY; Wattage: 1/16W; Tolerance: 5%; Footprint Ref: RES0402_0-5; PCB Footprint: RES0402_0-5
R266 = RESISTOR_Dup2: RES 100K 1/16W 1% 0402; Part Reference: R266; Mistral Part No: 110014060043-R; Mfr_name: VISHAY; Mfr_part_number: CRCW0402100KFKED; Part_type: RESISTORS\FIXED; Project: QCS610_NANOSOM; Voltage: NA; Customs_HS_Code: 85332119; Custom_Duty: 15%; Value: 100K_1%; Footprint Ref: RES0402_0-5; Tolerance: 1%; Wattage: 1/16W; Package: 0402; Distributor_name: DIGIKEY; Distributor_part_number: 541-100KLCT-ND; Library Ref: RESISTOR; Height: 0.40MM; Weight: 11mg; Temperature: -55°C+155°C; Datasheet: Y:\MIS_DATABASE\DATASHEETS\RESISTORS\CRCW0603.PDF; Crtd /date: ALVY/250520; Chkd/date: MANIRAJA/300520; MECHANICAL 3D STEP FILE: RES0402_0-5; Library Path: Y:\MIS_DATABASE\Library\ALTIUM_TOOL\SCHEMATICS_PARTS\MS_DISCRETE_Library.schlib; Footprint Path: Y:\MIS_DATABASE\Library\ALTIUM_TOOL\PCB_FOOTPRINTS\Altium_Footprint_Lib.PcbLib; PCB Footprint: RES0402_0-5
R548 = RESISTOR_Dup2: RES 5.23K 1/16W 1% 0402; Part Reference: R548; Mistral Part No: 110015080018-R; Mfr_name: VISHAY; Mfr_part_number: CRCW04025K23FKED; Part_type: RESISTORS\FIXED; Project: OCTASIC_3000; Voltage: NA; Customs_HS_Code: 85332119; Custom_Duty: 15%; Value: 5.23K_1%; Footprint Ref: RES0402_0-5; Tolerance: 1%; Wattage: 1/16W; Package: 0402; Distributor_name: DIGIKEY; Distributor_part_number: 541-5.23KLCT-ND; Library Ref: RESISTOR; Height: 0.40MM; Weight: 0.65mg; Temperature: -55°C+155°C; Datasheet: Y:\MIS_DATABASE\DATASHEETS\RESISTORS\CRCW0603.PDF; Crtd /date: JEBRAN/110815; Chkd/date: JEBRAN/110815; MECHANICAL 3D STEP FILE: RES0402_0-5; Library Path: Y:\MIS_DATABASE\Library\ALTIUM_TOOL\SCHEMATICS_PARTS\MS_DISCRETE_Library.schlib; Footprint Path: Y:\MIS_DATABASE\Library\ALTIUM_TOOL\PCB_FOOTPRINTS\Altium_Footprint_Lib.PcbLib; PCB Footprint: RES0402_0-5
R554 = RESISTOR_Dup2: RES 10K 1/16W 5% 0402; Part Reference: R554; Part_type: RESISTORS\FIXED; Mfr_part_number: RC0402JR-0710KL; Mfr_name: YAGEO AMERICA; Mistral Part No: 110011060021-R; Custom_Duty: 15%; Customs_HS_Code: 85332119; Voltage: NA; Project: HSE; Value: 10K; Footprint Path: Y:\MIS_DATABASE\Library\ALTIUM_TOOL\PCB_FOOTPRINTS\Altium_Footprint_Lib.PcbLib; Library Path: Y:\MIS_DATABASE\Library\ALTIUM_TOOL\SCHEMATICS_PARTS\MS_DISCRETE_Library.schlib; Footprint Ref: RES0402_0-5; Library Ref: RESISTOR; Chkd/date: VASANTHA/061216; Crtd /date: MAZHAR/230805; Datasheet: Y:\MIS_DATABASE\DATASHEETS\RESISTORS\RCXXXXL-SER_MAR18.PDF; Temperature: -55°C+155°C; Weight: 0.65mg; Height: 0.40MM; Distributor_part_number: 311-10KJRCT-ND; Distributor_name: DIGIKEY; Package: 0402; Wattage: 1/16W; Tolerance: 5%; MECHANICAL 3D STEP FILE: RES0402_0-5; Manufacturer: YAGEO AMERICA; PCB Footprint: RES0402_0-5
TP77 = TESTPOINT_Dup1: TESTPOINT CIR 30 SMD; Part Reference: TP77; Mistral Part No: 130009030930; Mfr_name: LOCAL; Project: BT MODULE_CSRBC04; Tolerance: NA; Value: TP30_SMD; Library Ref: TESTPOINT; Mfr_part_number: TP30_SMD; Part_type: TESTPOINT; Package: SMD; Distributor_name: NA; Distributor_part_number: NA; Height: NA; Crtd /date: MAZHAR/171006; Chkd/date: SHREESHAIL/171006; Datasheet: NA; Footprint Ref: TP30_SMD; Voltage: NA; Wattage: NA; Weight: NA; Temperature: NA; RoHS: NA; Customs_HS_Code: NA; Custom_Duty: NA; MECHANICAL 3D STEP FILE: NA; Library Path: Y:\MIS_DATABASE\Library\ALTIUM_TOOL\SCHEMATICS_PARTS\MS_DISCRETE_Library.schlib; Footprint Path: Y:\MIS_DATABASE\Library\ALTIUM_TOOL\PCB_FOOTPRINTS\Altium_Footprint_Lib.PcbLib; PCB Footprint: TP30_SMD
TP90 = TESTPOINT_Dup1: TESTPOINT 1.0MM DRILL PTH; Part Reference: TP90; Mfr_name: LOCAL; Mistral Part No: 130009030938; Project: HSE; Value: THRU HOLE; Datasheet: NA; Chkd/date: MAZHAR/271211; Crtd /date: SHREESHAIL/041005; Height: NA; Distributor_part_number: NA; Distributor_name: NA; Package: THRU-HOLE; Part_type: TESTPOINT; Mfr_part_number: TP_40X65; Library Ref: TESTPOINT; PCB Footprint: TP_40X65
U51 = LM61460_VQFNHR14: IC 6A ADJ AUTO LOW EMI SYNCHRONOUS STEP DOWN DC-DC CONVERTER VQFN-HR14; Part Reference: U51; Mistral Part No: 142021020006-R; Mfr_name: TEXAS INSTRUMENTS; Part_type: ICS\POWER\DC-DC CONVERTER; Project: J7ES_SK_BRD; Tolerance: NA; Customs_HS_Code: 85423100; Custom_Duty: 15%; Value: LM61460AANQRJRRQ1; PCB Footprint: VQFNHR14_LM61460_160X140_1; Footprint Ref: VQFNHR14_LM61460_160X140_1; Mfr_part_number: LM61460AANQRJRRQ1; Voltage: NA; Wattage: NA; Package: VQFN-HR14; Distributor_name: DIGIKEY; Distributor_part_number: 296-LM61460AANQRJRRQ1TR-ND; Library Ref: LM61460_VQFNHR14; Height: 1.00MM; Weight: NA; Temperature: -40°C+150°C; Datasheet: Y:\MIS_DATABASE\DATASHEETS\ICS\POWER\LM61460-Q1.PDF; Crtd /date: MANIRAJA/030221; Chkd/date: ALVY/040221; MECHANICAL 3D STEP FILE: VQFNHR14_LM61460_160X140_1; Library Path: Y:\MIS_DATABASE\Library\ALTIUM_TOOL\SCHEMATICS_PARTS\MS_MISCPOWER_Library.schlib; Footprint Path: Y:\MIS_DATABASE\Library\ALTIUM_TOOL\PCB_FOOTPRINTS\Altium_Footprint_Lib.PcbLib
U55 = TPS54308DDCT_SOT23-6: IC 3A 4.5-28V EMI FRIENDLY SYNCHRONOUS STEP DOWN CONVERTER SOT23-6; Part Reference: U55; Part_type: ICS\POWER\CONVERTER; Mfr_name: TEXAS INSTRUMENTS; Mistral Part No: 142022080027-R; Custom_Duty: 15%; Customs_HS_Code: 85423100; Wattage: NA; Project: J7ES_SOM_DUAL-LEO_PMIC; Value: TPS54302DDCR; MECHANICAL 3D STEP FILE: SOT23-6_1-1; Chkd/date: PRAVEEN/110822; Crtd /date: PRAVEEN/110822; Datasheet: Y:\MIS_DATABASE\DATASHEETS\ICS\POWER\TPS54302D.PDF; Temperature: -40°C+125°C; Weight: NA; Height: 1.10MM; Library Ref: TPS54308DDCT_SOT23-6; Distributor_part_number: 296-46237-1-ND; Distributor_name: DIGIKEY; Package: SOT23-6; Voltage: NA; Tolerance: NA; Mfr_part_number: TPS54302DDCR; PCB Footprint: SOT23-6_1-1